# Altium schematic sheet 2_mppt_circuits.schdoc: Power Circuits
size A4; Engineer: Eng_2_ALT; SheetNumber: 3; SheetTotal: 3; Designed by: André M. P. Mattos; Version: v0.1
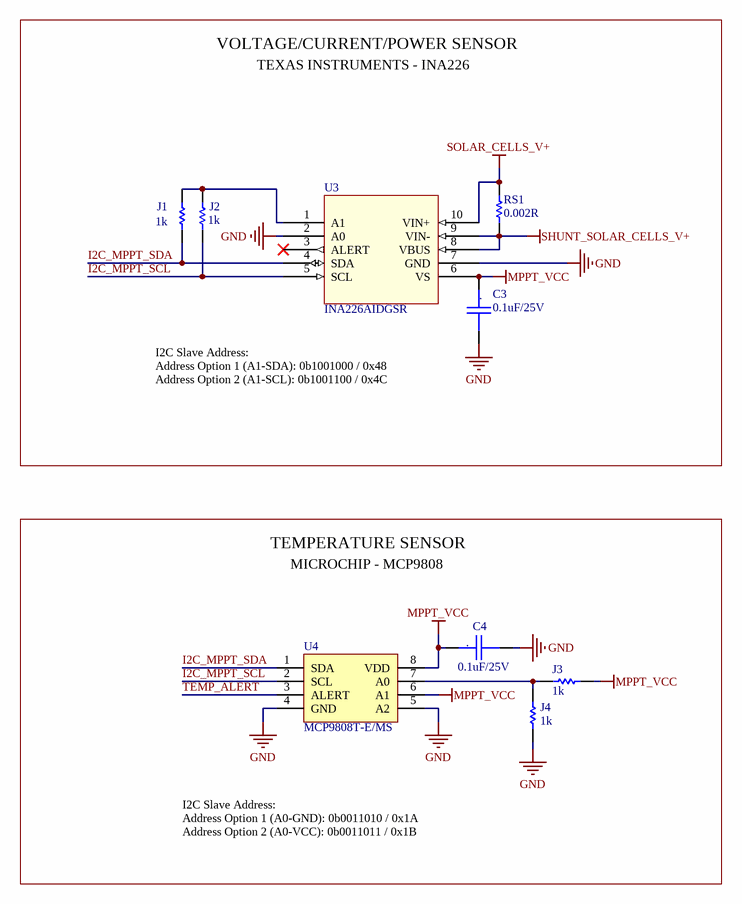
[diagram p0: 2_mppt_circuits.schdoc]

## Parts
C3  0.1uF/25V  [CC0805]
C4  0.1uF/25V  [CC0805]
J1  1k  [0805]
J2  1k  [0805]
J3  1k  [0805]
J4  1k  [0805]
RS1  0.002R  [0805]
U3  INA226AIDGSR  [DGS10]
U4  MCP9808T-E/MS  [MSOP-8]

## Blocks framed on the sheet
VOLTAGE/CURRENT/POWER SENSOR: C3 J1 J2 RS1 U3
TEMPERATURE SENSOR: C4 J3 J4 U4

## Nets
GND: C3.2 C4.2 J4.1 U3.2(A0) U3.7(GND) U4.4(GND) U4.5(A2)
MPPT_VCC: C3.1 C4.1 J3.1 U3.6(VS) U4.6(A1) U4.8(VDD)
SHUNT_SOLAR_CELLS_V+: RS1.1 U3.8(VBUS) U3.9(VIN-)
SOLAR_CELLS_V+: RS1.2 U3.10(VIN+)
I2C_MPPT_SCL: J2.1 U3.5(SCL) U4.2(SCL)
I2C_MPPT_SDA: J1.1 U3.4(SDA) U4.1(SDA)
TEMP_ALERT: U4.3(ALERT)
NetJ1_2: J1.2 J2.2 U3.1(A1)
NetJ3_2: J3.2 J4.2 U4.7(A0)

Not connected (* = marked no-connect by the designer): U3 3(ALERT)*

## Notes on the sheet
- TEXAS INSTRUMENTS - INA226
- I2C Slave Address:
  Address Option 1 (A1-SDA): 0b1001000 / 0x48
  Address Option 2 (A1-SCL): 0b1001100 / 0x4C
- MICROCHIP - MCP9808
- I2C Slave Address:
  Address Option 1 (A0-GND): 0b0011010 / 0x1A
  Address Option 2 (A0-VCC): 0b0011011 / 0x1B
- Project:
- SpaceLab - Federal University of Santa Catarina
- Title:
- Designed by:
- Date:
- Version:
- Sheet
- of
- Size:
- A4
- (in symbol Cap_Cer_X7R_0.1uF_25V_0805) .

## Library data of the parts
C3 C4 = Cap_Cer_X7R_0.1uF_25V_0805: CAP CER 0.1UF 25V 10% X7R 0805; Partnumber: CC0805KRX7R8BB104; NCM: 8532.24.10
J1-J4 = R1.0k_1%_1/8W_0805: RES 1.0K OHM 1/8W 1% 0805; Partnumber: RC0805FR-071KL; NCM: 8533.21.20
RS1 = R0.002R_3%_0.5W_0805: Current Sense Resistors - SMD 0.002 ohm 3% 0.5W Current Sense; Partnumber: LVT08R0020HER
U3 = INA226AIDGSR: High-Side Measurement, Bi-Directional Current/Power Monitor w/I2C Interface; Manufacturer: Texas Instruments; GENERIC_PART_NUMBER: INA226; INDUSTRY_STD_PKG_TYPE: MSOP; FAMILY_NAME: CURRENT SHUNT MONITOR; PIN_COUNT: 10; PACKAGE_DESIGNATOR: DGS; Datasheet_URL: http://www.ti.com/lit/gpn/INA226; Vendor: Texas Instruments; Manufacturer_Part_Number: INA226AIDGSR; Copyright: Copyright (C) 2018 Accelerated Designs. All rights reserved; RefDes: RefDes; Type: DEV
U4 = MCP9808: Partnumber: MCP9808T-E/MS